# Altium schematic sheet bh_ai8&di8_alph.SchDoc
size A3
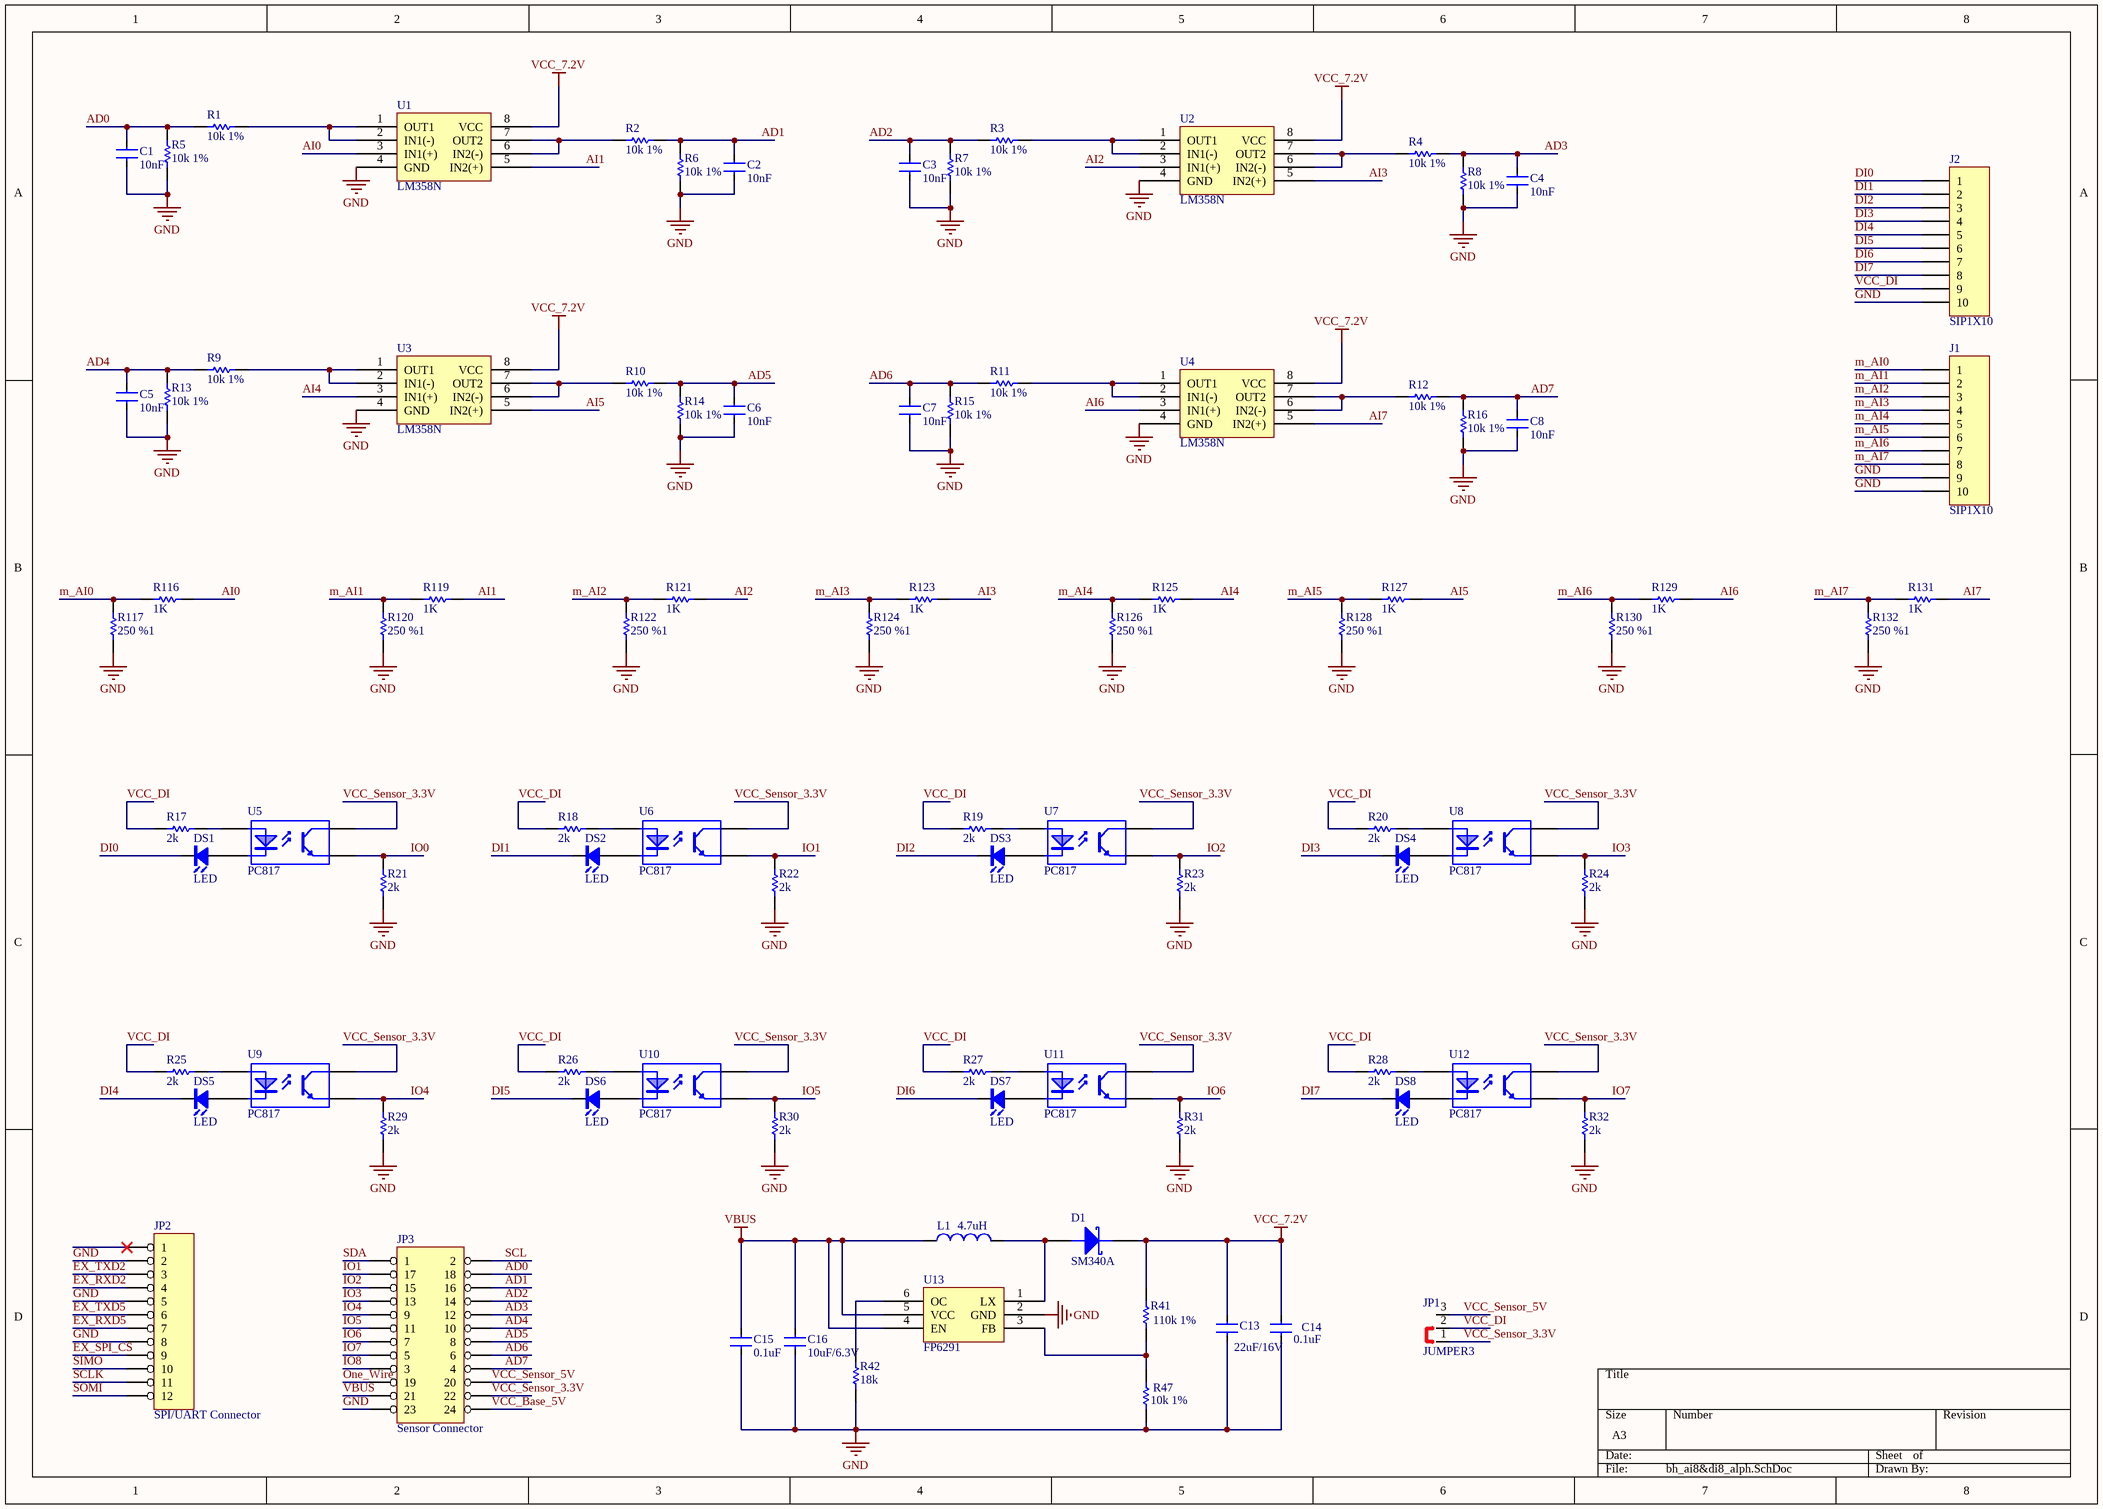
[diagram p0: bh_ai8&di8_alph.SchDoc]

## Parts
C1  10nF  [C0603]
C2  10nF  [C0603]
C3  10nF  [C0603]
C4  10nF  [C0603]
C5  10nF  [C0603]
C6  10nF  [C0603]
C7  10nF  [C0603]
C8  10nF  [C0603]
C13  22uF/16V  [C0805]
C14  0.1uF  [C0603]
C15  0.1uF  [C0603]
C16  10uF/6.3V  [C0805]
D1  SM340A  [DO-214]
DS1  LED  [D0805]
DS2  LED  [D0805]
DS3  LED  [D0805]
DS4  LED  [D0805]
DS5  LED  [D0805]
DS6  LED  [D0805]
DS7  LED  [D0805]
DS8  LED  [D0805]
J1  SIP1X10  [CON10*0.381]
J2  SIP1X10  [CON10*0.381]
JP1  JUMPER3  [SIP1X3X2.54]
JP2  SPI/UART Connector  [SIP1x12x2.54]
JP3  Sensor Connector  [SIP2X12X2.54]
L1  4.7uH  [R1206]
R1  10k 1%  [R0603]
R2  10k 1%  [R0603]
R3  10k 1%  [R0603]
R4  10k 1%  [R0603]
R5  10k 1%  [R0603]
R6  10k 1%  [R0603]
R7  10k 1%  [R0603]
R8  10k 1%  [R0603]
R9  10k 1%  [R0603]
R10  10k 1%  [R0603]
R11  10k 1%  [R0603]
R12  10k 1%  [R0603]
R13  10k 1%  [R0603]
R14  10k 1%  [R0603]
R15  10k 1%  [R0603]
R16  10k 1%  [R0603]
R17  2k  [R0603]
R18  2k  [R0603]
R19  2k  [R0603]
R20  2k  [R0603]
R21  2k  [R0603]
R22  2k  [R0603]
R23  2k  [R0603]
R24  2k  [R0603]
R25  2k  [R0603]
R26  2k  [R0603]
R27  2k  [R0603]
R28  2k  [R0603]
R29  2k  [R0603]
R30  2k  [R0603]
R31  2k  [R0603]
R32  2k  [R0603]
R41  110k 1%  [R0603]
R42  18k  [R0603]
R47  10k 1%  [R0603]
R116  1K  [R0603]
R117  250 %1  [R0603]
R119  1K  [R0603]
R120  250 %1  [R0603]
R121  1K  [R0603]
R122  250 %1  [R0603]
R123  1K  [R0603]
R124  250 %1  [R0603]
R125  1K  [R0603]
R126  250 %1  [R0603]
R127  1K  [R0603]
R128  250 %1  [R0603]
R129  1K  [R0603]
R130  250 %1  [R0603]
R131  1K  [R0603]
R132  250 %1  [R0603]
U1  LM358N  [SO8NB]
U2  LM358N  [SO8NB]
U3  LM358N  [SO8NB]
U4  LM358N  [SO8NB]
U5  PC817  [SOP_4]
U6  PC817  [SOP_4]
U7  PC817  [SOP_4]
U8  PC817  [SOP_4]
U9  PC817  [SOP_4]
U10  PC817  [SOP_4]
U11  PC817  [SOP_4]
U12  PC817  [SOP_4]
U13  FP6291  [SOT23-6]

## Nets
GND: C1.2 C2.2 C3.2 C4.2 C5.2 C6.2 C7.2 C8.2 C13.2 C14.2 C15.2 C16.2 J1.9 J1.10 J2.10 JP2.2 JP2.5 JP2.8 JP3.23 R5.2 R6.2 R7.2 R8.2 R13.2 R14.2 R15.2 R16.2 R21.2 R22.2 R23.2 R24.2 R29.2 R30.2 R31.2 R32.2 R42.1 R47.1 R117.2 R120.2 R122.2 R124.2 R126.2 R128.2 R130.2 R132.2 U1.4(GND) U2.4(GND) U3.4(GND) U4.4(GND) U13.2(GND)
VBUS: C15.1 C16.1 JP3.21 L1.1 U13.4(EN) U13.5(VCC)
VCC_7.2V: C13.1 C14.1 D1.2(K) R41.2 U1.8(VCC) U2.8(VCC) U3.8(VCC) U4.8(VCC)
AD0: C1.1 JP3.18 R1.2 R5.1
AD1: C2.1 JP3.16 R2.1 R6.1
AD2: C3.1 JP3.14 R3.2 R7.1
AD3: C4.1 JP3.12 R4.1 R8.1
AD4: C5.1 JP3.10 R9.2 R13.1
AD5: C6.1 JP3.8 R10.1 R14.1
AD6: C7.1 JP3.6 R11.2 R15.1
AD7: C8.1 JP3.4 R12.1 R16.1
AI0: R116.1 U1.3(IN1(+))
AI1: R119.1 U1.5(IN2(+))
AI2: R121.1 U2.3(IN1(+))
AI3: R123.1 U2.5(IN2(+))
AI4: R125.1 U3.3(IN1(+))
AI5: R127.1 U3.5(IN2(+))
AI6: R129.1 U4.3(IN1(+))
AI7: R131.1 U4.5(IN2(+))
DI0: DS1.K J2.1
DI1: DS2.K J2.2
DI2: DS3.K J2.3
DI3: DS4.K J2.4
DI4: DS5.K J2.5
DI5: DS6.K J2.6
DI6: DS7.K J2.7
DI7: DS8.K J2.8
EX_RXD2: JP2.4
EX_RXD5: JP2.7
EX_SPI_CS: JP2.9
EX_TXD2: JP2.3
EX_TXD5: JP2.6
IO0: R21.1 U5.3(E)
IO1: JP3.17 R22.1 U6.3(E)
IO2: JP3.15 R23.1 U7.3(E)
IO3: JP3.13 R24.1 U8.3(E)
IO4: JP3.9 R29.1 U9.3(E)
IO5: JP3.11 R30.1 U10.3(E)
IO6: JP3.7 R31.1 U11.3(E)
IO7: JP3.5 R32.1 U12.3(E)
IO8: JP3.3
m_AI0: J1.1 R116.2 R117.1
m_AI1: J1.2 R119.2 R120.1
m_AI2: J1.3 R121.2 R122.1
m_AI3: J1.4 R123.2 R124.1
m_AI4: J1.5 R125.2 R126.1
m_AI5: J1.6 R127.2 R128.1
m_AI6: J1.7 R129.2 R130.1
m_AI7: J1.8 R131.2 R132.1
One_Wire: JP3.19
SCL: JP3.2
SCLK: JP2.11
SDA: JP3.1
SIMO: JP2.10
SOMI: JP2.12
VCC_Base_5V: JP3.24
VCC_DI: J2.9 JP1.2 R17.2 R18.2 R19.2 R20.2 R25.2 R26.2 R27.2 R28.2
VCC_Sensor_3.3V: JP1.1 JP3.22 U5.4(C) U6.4(C) U7.4(C) U8.4(C) U9.4(C) U10.4(C) U11.4(C) U12.4(C)
VCC_Sensor_5V: JP1.3 JP3.20
NetD1_1: D1.1(A) L1.2 U13.1(LX)
NetDS1_A: DS1.A U5.2(K)
NetDS2_A: DS2.A U6.2(K)
NetDS3_A: DS3.A U7.2(K)
NetDS4_A: DS4.A U8.2(K)
NetDS5_A: DS5.A U9.2(K)
NetDS6_A: DS6.A U10.2(K)
NetDS7_A: DS7.A U11.2(K)
NetDS8_A: DS8.A U12.2(K)
NetR1_1: R1.1 U1.1(OUT1) U1.2(IN1(-))
NetR2_2: R2.2 U1.6(IN2(-)) U1.7(OUT2)
NetR3_1: R3.1 U2.1(OUT1) U2.2(IN1(-))
NetR4_2: R4.2 U2.6(IN2(-)) U2.7(OUT2)
NetR9_1: R9.1 U3.1(OUT1) U3.2(IN1(-))
NetR10_2: R10.2 U3.6(IN2(-)) U3.7(OUT2)
NetR11_1: R11.1 U4.1(OUT1) U4.2(IN1(-))
NetR12_2: R12.2 U4.6(IN2(-)) U4.7(OUT2)
NetR17_1: R17.1 U5.1(A)
NetR18_1: R18.1 U6.1(A)
NetR19_1: R19.1 U7.1(A)
NetR20_1: R20.1 U8.1(A)
NetR25_1: R25.1 U9.1(A)
NetR26_1: R26.1 U10.1(A)
NetR27_1: R27.1 U11.1(A)
NetR28_1: R28.1 U12.1(A)
NetR41_1: R41.1 R47.2 U13.3(FB)
NetR42_2: R42.2 U13.6(OC)

Not connected (* = marked no-connect by the designer): JP2 1*

## Library data of the parts
C1-C8 C13-C16 = CAP-SMD: SMD-CAP
  C1-C8: Value: 10nF
  C13: Value: 22uF/16V
  C14 C15: Value: 0.1uF
  C16: Value: 10uF/6.3V
D1 = DIODE SCHOTTKY: Schottky Diode
J1 J2 = SIP1X10: Connector
JP1 = JUMPER3: Jumper
JP2 = SIP1X12: 单排排针直角
JP3 = SIP2X12: 双排排针直角
L1 = INDUCTOR: Value: 4.7uH
R1-R32 R41 R42 R47 R116 R117 R119-R132 = RES: Resistor
  R1-R16 R47: Value: 10k 1%
  R17-R32: Value: 2k
  R41: Value: 110k 1%
  R42: Value: 18k
  R116 R119 R121 R123 R125 R127 R129 R131: Value: 1K
  R117 R120 R122 R124 R126 R128 R130 R132: Value: 250 %1
U5-U12 = P521*1: Published: 24-Mar-1999; LatestRevisionDate: 17-Jul-2002; LatestRevisionNote: Re-released for DXP Platform.; Publisher: Altium Limited